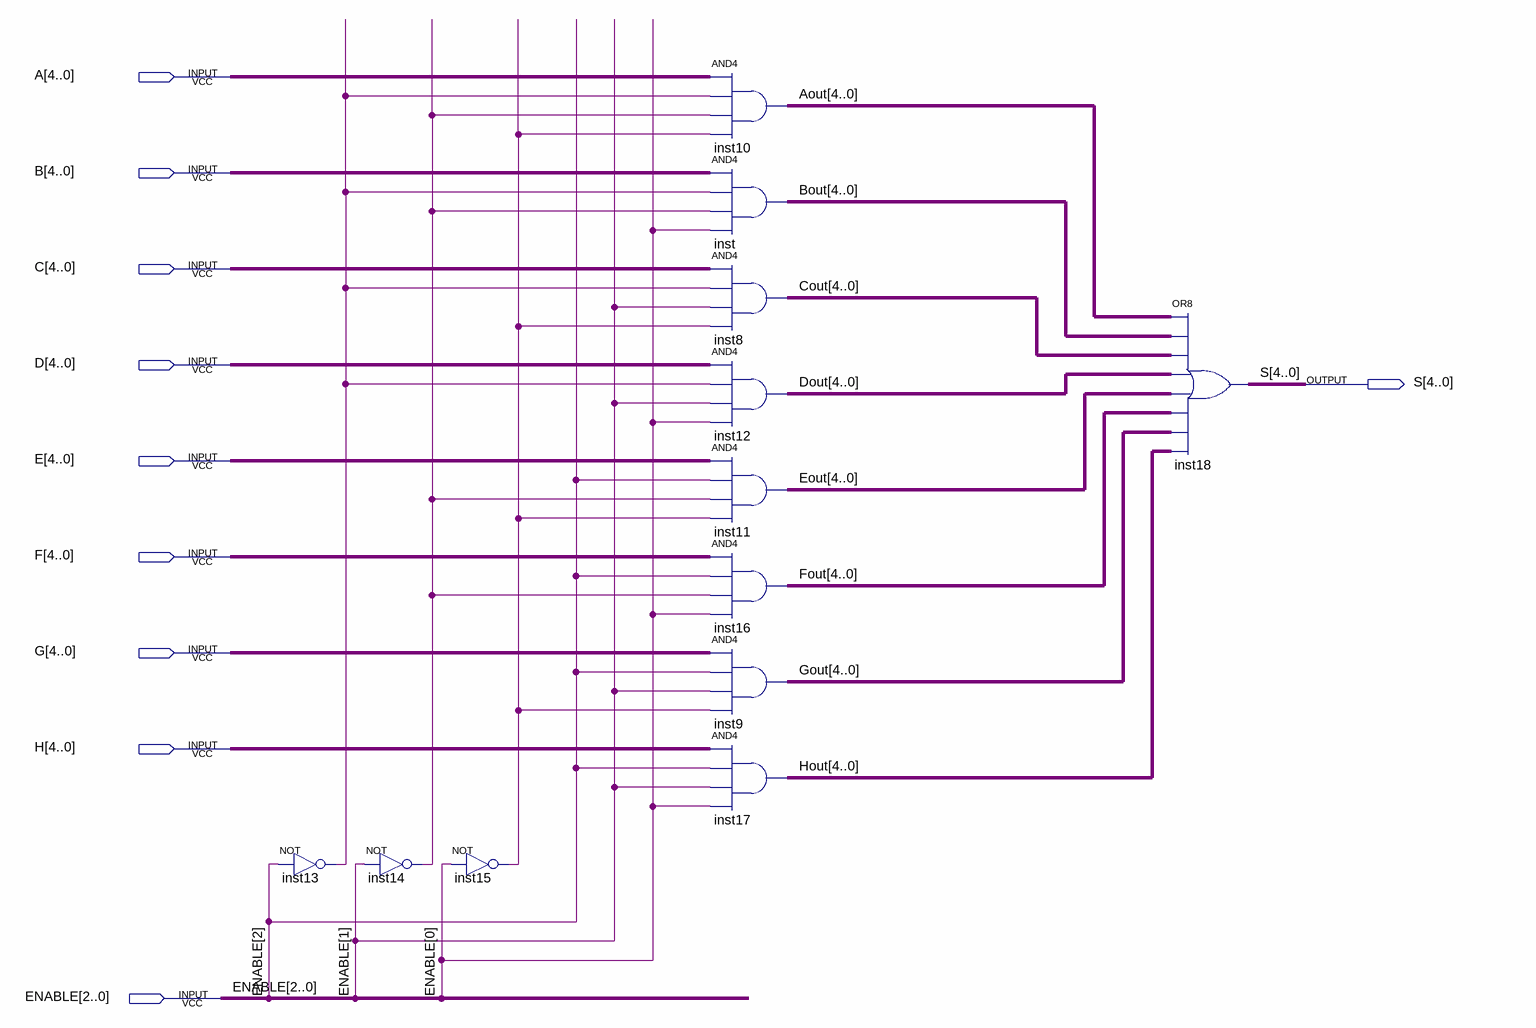
[diagram p0: schematic sheet]
// Quartus schematic mux.bdf as structural Verilog: 12 symbols, 10 pins
module mux (
  input  [4:0] A,
  input  [4:0] B,
  input  [4:0] C,
  input  [4:0] D,
  input  [4:0] E,
  input  [4:0] F,
  input  [4:0] G,
  input  [4:0] H,
  input  [2:0] ENABLE,
  output [4:0] S
);

  wire inst13_out, inst14_out, inst15_out;
  wire [4:0] Aout, Bout, Cout, Dout, Eout, Fout, Gout, Hout;

  not inst13 (inst13_out, ENABLE[2]);
  not inst14 (inst14_out, ENABLE[1]);
  not inst15 (inst15_out, ENABLE[0]);
  assign Aout = A & {5{inst13_out}} & {5{inst14_out}} & {5{inst15_out}};  // AND4 inst10, 5 bits wide
  assign Bout = B & {5{inst13_out}} & {5{inst14_out}} & {5{ENABLE[0]}};  // AND4 inst, 5 bits wide
  assign Cout = C & {5{inst13_out}} & {5{ENABLE[1]}} & {5{inst15_out}};  // AND4 inst8, 5 bits wide
  assign Dout = D & {5{inst13_out}} & {5{ENABLE[1]}} & {5{ENABLE[0]}};  // AND4 inst12, 5 bits wide
  assign Eout = E & {5{ENABLE[2]}} & {5{inst14_out}} & {5{inst15_out}};  // AND4 inst11, 5 bits wide
  assign Fout = F & {5{ENABLE[2]}} & {5{inst14_out}} & {5{ENABLE[0]}};  // AND4 inst16, 5 bits wide
  assign Gout = G & {5{ENABLE[2]}} & {5{ENABLE[1]}} & {5{inst15_out}};  // AND4 inst9, 5 bits wide
  assign Hout = H & {5{ENABLE[2]}} & {5{ENABLE[1]}} & {5{ENABLE[0]}};  // AND4 inst17, 5 bits wide
  assign S = Aout | Bout | Cout | Dout | Eout | Fout | Gout | Hout;  // OR8 inst18, 5 bits wide
endmodule
